# EAGLE design LTM8055 AddonBoard v1.0 (EAGLE 6.4)
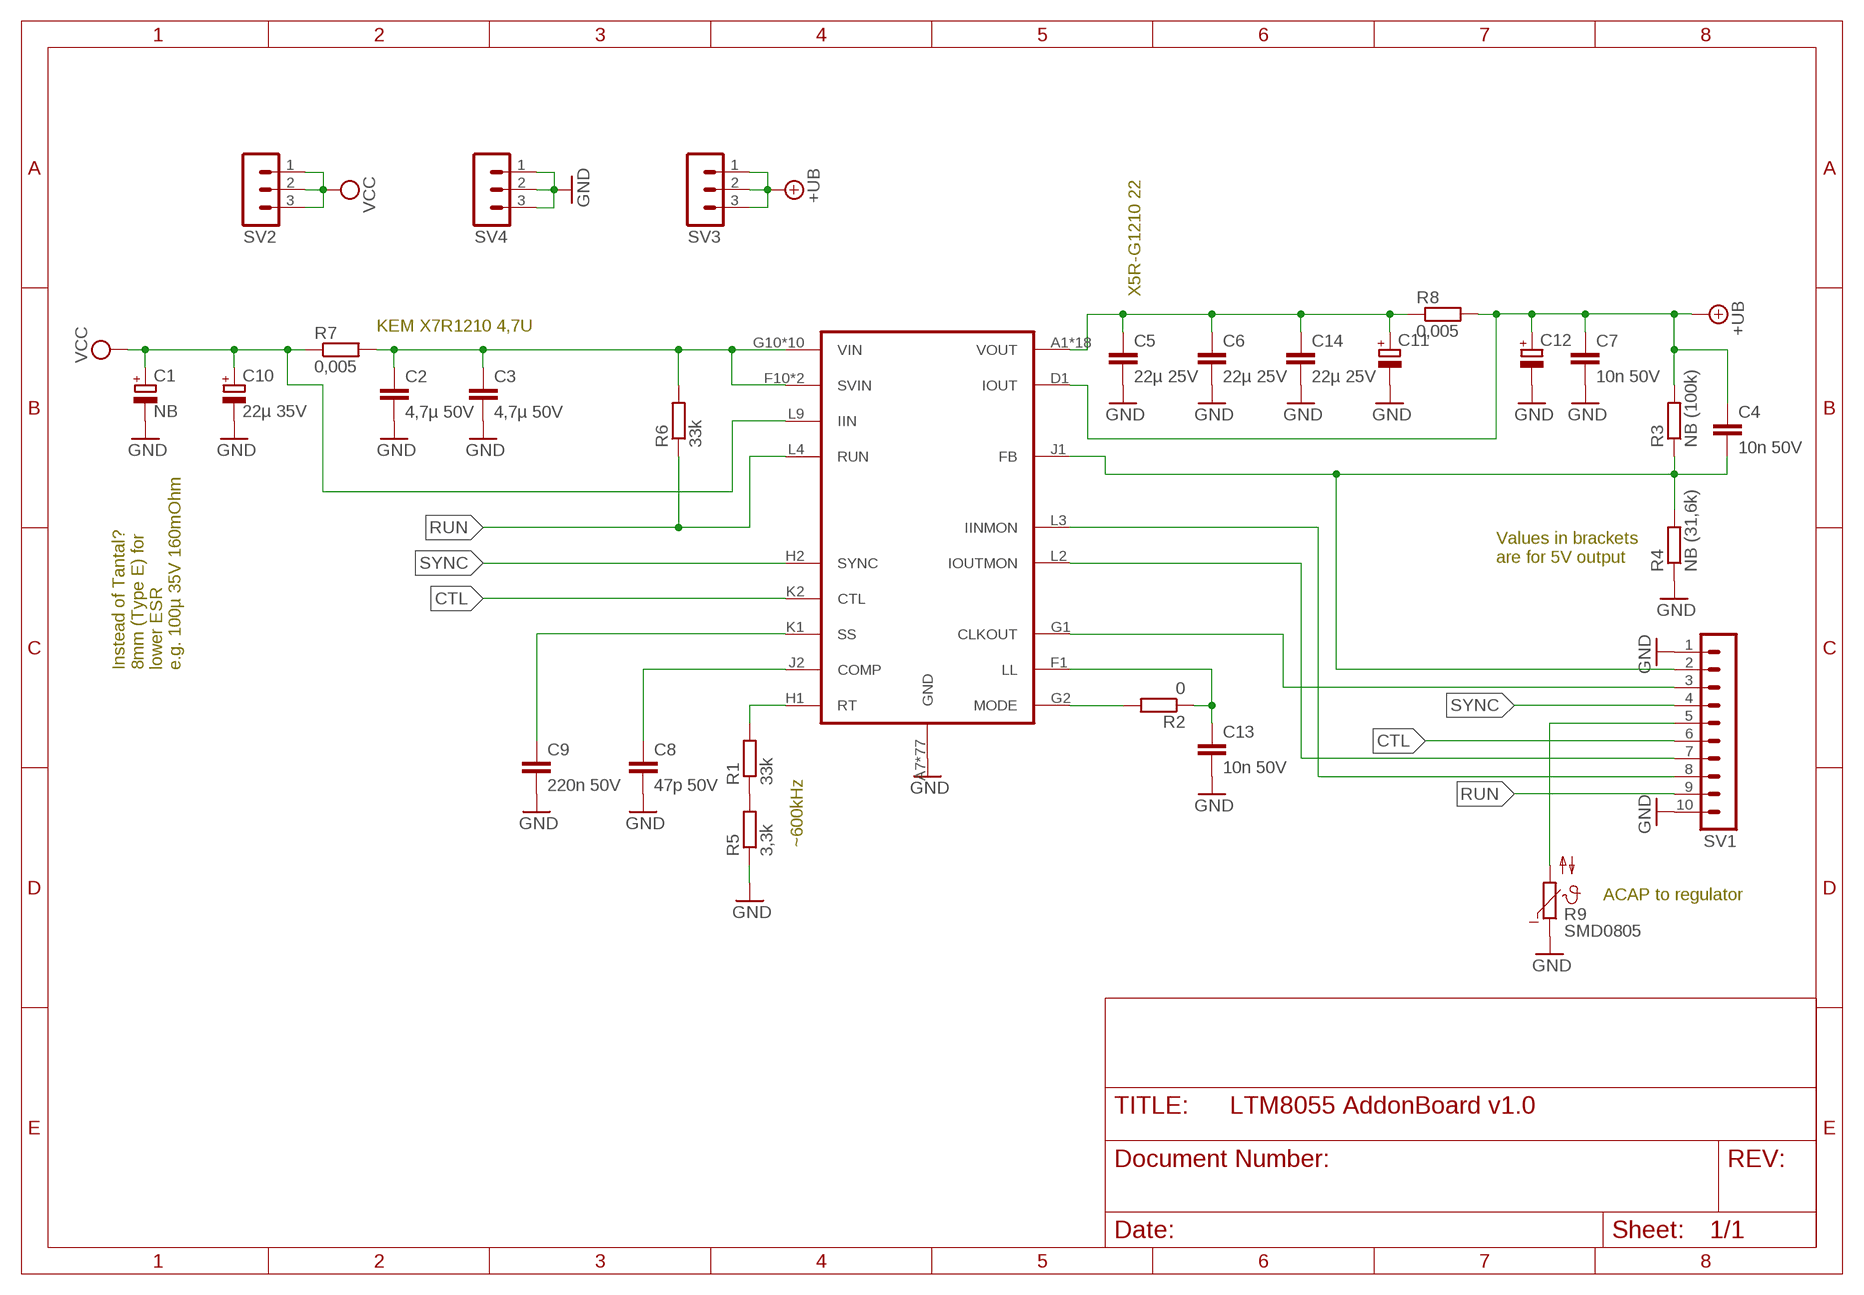
[diagram p0: schematic, sheet 1]

## Parts
C1  NB  CPOL-EUE  [PANASONIC_E]
C2  4,7µ 50V  C-EUC1206  [C1206]
C3  4,7µ 50V  C-EUC1206  [C1206]
C4  10n 50V  C-EUC0805  [C0805]
C5  22µ 25V  C-EUC1210  [C1210]
C6  22µ 25V  C-EUC1210  [C1210]
C7  10n 50V  C-EUC0805  [C0805]
C8  47p 50V  C-EUC0805  [C0805]
C9  220n 50V  C-EUC0805  [C0805]
C10  22µ 35V  CPOL-EUD/7343-31R  [D/7343-31R]
C11  CPOL-EUD/7343-31R  [D/7343-31R]
C12  CPOL-EUD/7343-31R  [D/7343-31R]
C13  10n 50V  C-EUC0805  [C0805]
C14  22µ 25V  C-EUC1210  [C1210]
IC1  LTM8055-1  [BGA121_1.27_15X15MM]
R1  33k  R-EU_R0805  [R0805]
R2  0  R-EU_R0805  [R0805]
R3  NB (100k)  R-EU_R0805  [R0805]
R4  NB (31,6k)  R-EU_R0805  [R0805]
R5  3,3k  R-EU_R0805  [R0805]
R6  33k  R-EU_R0805  [R0805]
R7  0,005  R-EU_R2512  [R2512]
R8  0,005  R-EU_R2512  [R2512]
R9  SMD0805  [R0805]
SV1  MA10-1  [MA10-1]
SV2  MA03-1  [MA03-1]
SV3  MA03-1  [MA03-1]
SV4  MA03-1  [MA03-1]

## Nets
+UB: C4.1 C7.1 C12.+ IC1.D1(IOUT) R3.2 R8.2 SV3.1 SV3.2 SV3.3
CTL: IC1.K2(CTL) SV1.6
GND: C1.- C2.2 C3.2 C5.2 C6.2 C7.2 C8.2 C9.2 C10.- C11.- C12.- C13.2 C14.2 IC1.A7(GND) IC1.A8(GND) IC1.A9(GND) IC1.A10(GND) IC1.A11(GND) IC1.B7(GND) IC1.B8(GND) IC1.B9(GND) IC1.B10(GND) IC1.B11(GND) IC1.C7(GND) IC1.C8(GND) IC1.C9(GND) IC1.C10(GND) IC1.C11(GND) IC1.D2(GND) IC1.D3(GND) IC1.D4(GND) IC1.D5(GND) IC1.D6(GND) IC1.D7(GND) IC1.D8(GND) IC1.D9(GND) IC1.D10(GND) IC1.D11(GND) IC1.E1(GND) IC1.E2(GND) IC1.E3(GND) IC1.E4(GND) IC1.E5(GND) IC1.E6(GND) IC1.E7(GND) IC1.E8(GND) IC1.E9(GND) IC1.E10(GND) IC1.E11(GND) IC1.F2(GND) IC1.F3(GND) IC1.F4(GND) IC1.F5(GND) IC1.F6(GND) IC1.F7(GND) IC1.F8(GND) IC1.F9(GND) IC1.G3(GND) IC1.G4(GND) IC1.G5(GND) IC1.G6(GND) IC1.G7(GND) IC1.G8(GND) IC1.G9(GND) IC1.H3(GND) IC1.H4(GND) IC1.H5(GND) IC1.H6(GND) IC1.H7(GND) IC1.H8(GND) IC1.H9(GND) IC1.J3(GND) IC1.J4(GND) IC1.J5(GND) IC1.J6(GND) IC1.J7(GND) IC1.J8(GND) IC1.J9(GND) IC1.K3(GND) IC1.K4(GND) IC1.K5(GND) IC1.K6(GND) IC1.K7(GND) IC1.K8(GND) IC1.K9(GND) IC1.L1(GND) IC1.L5(GND) IC1.L6(GND) IC1.L7(GND) IC1.L8(GND) R4.1 R5.1 R9.1 SV1.1 SV1.10 SV4.1 SV4.2 SV4.3
N$1: C13.1 IC1.F1(LL) R2.1
N$2: IC1.G2(MODE) R2.2
N$3: IC1.G1(CLKOUT) SV1.3
N$4: C9.1 IC1.K1(SS)
N$5: C4.2 IC1.J1(FB) R3.1 R4.2 SV1.2
N$6: IC1.L2(IOUTMON) SV1.7
N$7: IC1.L3(IINMON) SV1.8
N$8: IC1.H1(RT) R1.2
N$9: C2.1 C3.1 IC1.F10(SVIN) IC1.F11(SVIN) IC1.G10(VIN) IC1.G11(VIN) IC1.H10(VIN) IC1.H11(VIN) IC1.J10(VIN) IC1.J11(VIN) IC1.K10(VIN) IC1.K11(VIN) IC1.L10(VIN) IC1.L11(VIN) R6.2 R7.2
N$10: R1.1 R5.2
N$11: C8.1 IC1.J2(COMP)
N$12: R9.2 SV1.5
N$14: C5.1 C6.1 C11.+ C14.1 IC1.A1(VOUT) IC1.A2(VOUT) IC1.A3(VOUT) IC1.A4(VOUT) IC1.A5(VOUT) IC1.A6(VOUT) IC1.B1(VOUT) IC1.B2(VOUT) IC1.B3(VOUT) IC1.B4(VOUT) IC1.B5(VOUT) IC1.B6(VOUT) IC1.C1(VOUT) IC1.C2(VOUT) IC1.C3(VOUT) IC1.C4(VOUT) IC1.C5(VOUT) IC1.C6(VOUT) R8.1
RUN: IC1.L4(RUN) R6.1 SV1.9
SYNC: IC1.H2(SYNC) SV1.4
VCC: C1.+ C10.+ IC1.L9(IIN) R7.1 SV2.1 SV2.2 SV2.3

## Notes on the sheet
- X5R-G1210 22
- KEM X7R1210 4,7U
- Values in brackets
  are for 5V output
- Instead of Tantal?
  8mm (Type E) for
  lower ESR
  e.g. 100µ 35V 160mOhm
- ~600kHz
- ACAP to regulator

## Library data of the parts
C1 C10-C12 = rcl:CPOL-EU: POLARIZED CAPACITOR, European symbol
C2-C9 C13 C14 = rcl:C-EU: CAPACITOR, European symbol
IC1 = linear-technology:LTM8055: LTM8055/LTM8055-1 36Vin, 8.5A Buck-Boost μModule Regulator FEATURES - Complete Buck-Boost Switch Mode Power Supply - VOUT Equal, Greater, Less Than VIN - Wide Input Voltage Range: 5V to 36V - 12V/3A Output from 6VIN - 12V/6A Output from 12VIN - 12V/8.5A Output from 24VIN - Up to 97.5% Efficient - Adjustable Input and Output Average Current Limits - Input and Output Current Monitors - Parallelable for Increased Output Current - Wide Output Voltage Range: 1.2V to 36V - Selectable Switching Frequency: 100kHz to 800kHz - Synchronization from 200kHz to 700kHz - External Compensation (LTM8055-1) - 15mm × 15mm × 4.92mm BGA Package APPLICATIONS - High Power Battery-Operated Devices - Industrial Control - Solar Powered Voltage Regulator - Solar Powered Battery Charging
R1-R8 = rcl:R-EU_: RESISTOR, European symbol
R9 = ptc-ntc:SMD0805: EPCOS NTC 0805
SV1 = con-lstb:MA10-1: PIN HEADER; OC_FARNELL: unknown; OC_NEWARK: unknown
SV2-SV4 = con-lstb:MA03-1: PIN HEADER; OC_FARNELL: unknown; OC_NEWARK: unknown

## Board
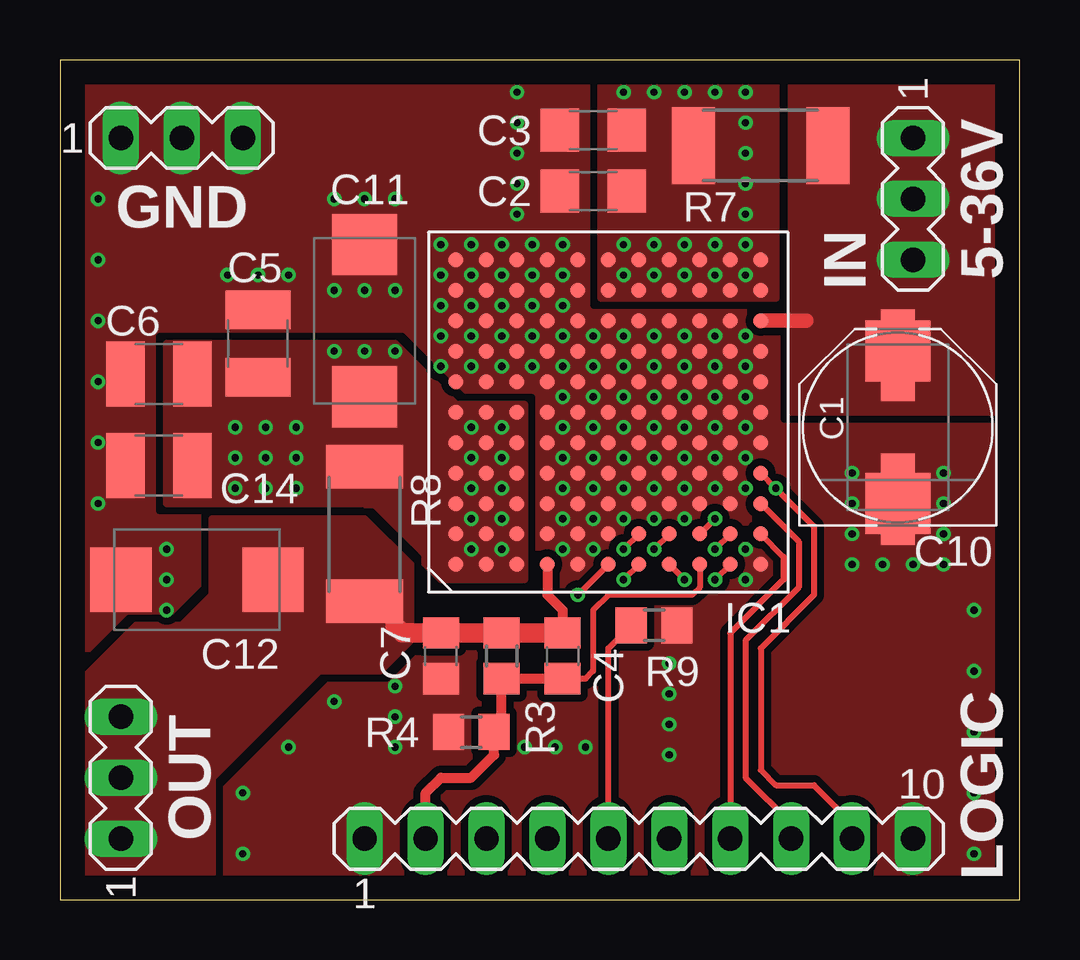
[diagram p1: board, top side]
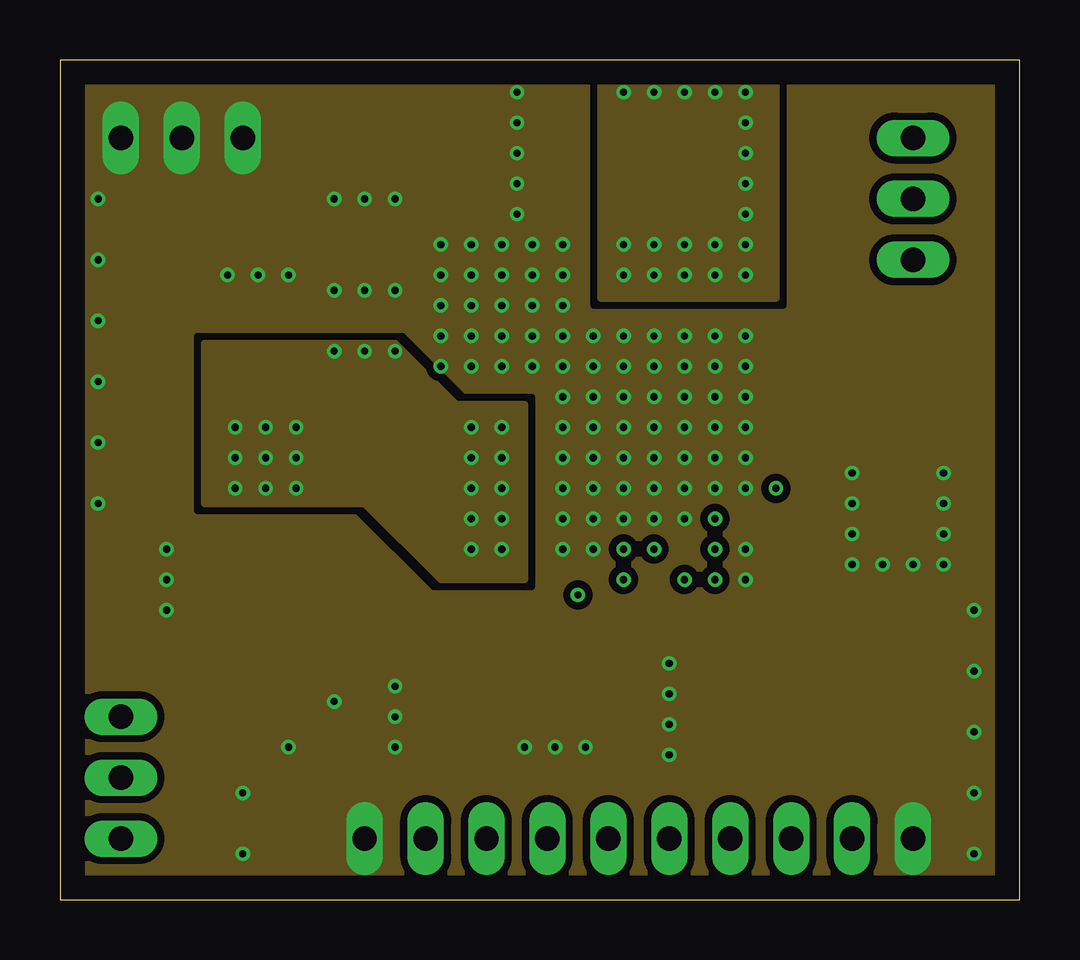
[diagram p2: board, inner layer InnerTop]
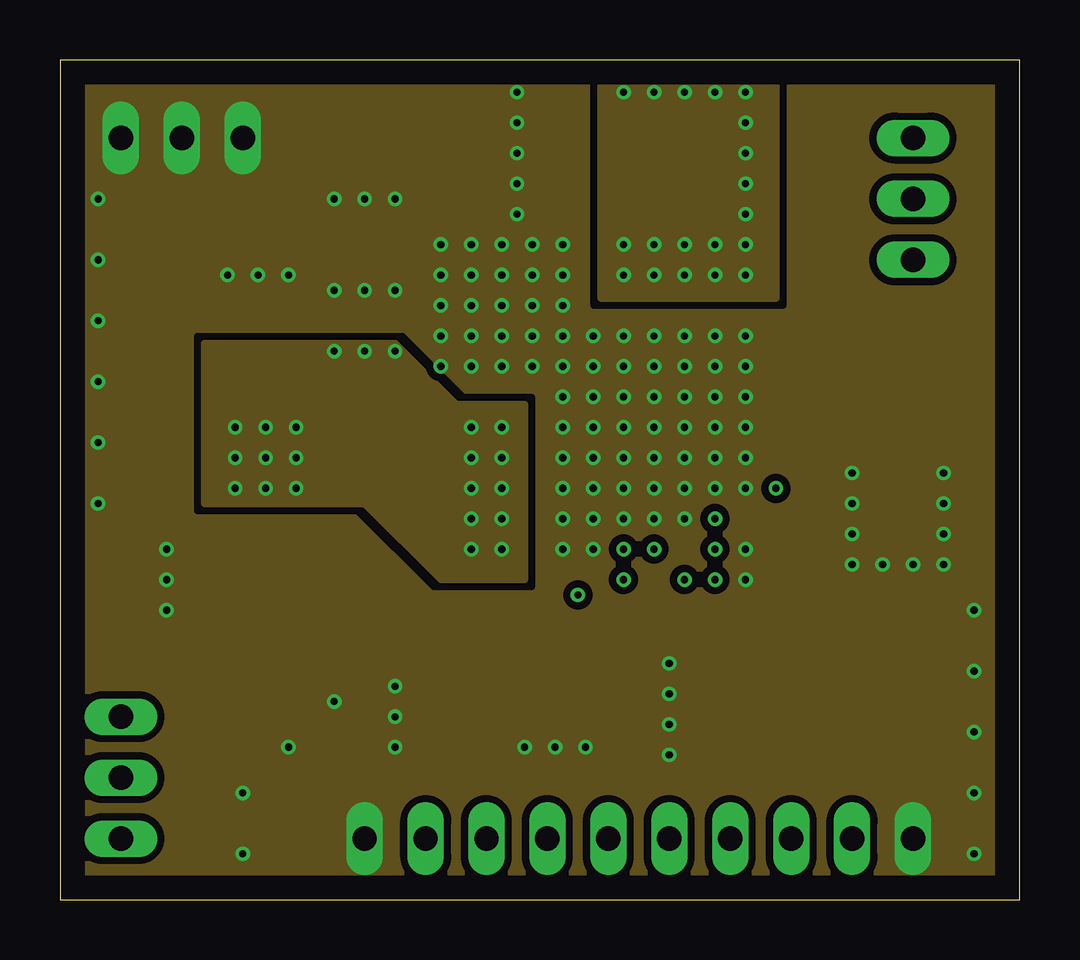
[diagram p3: board, inner layer InnerBottom]
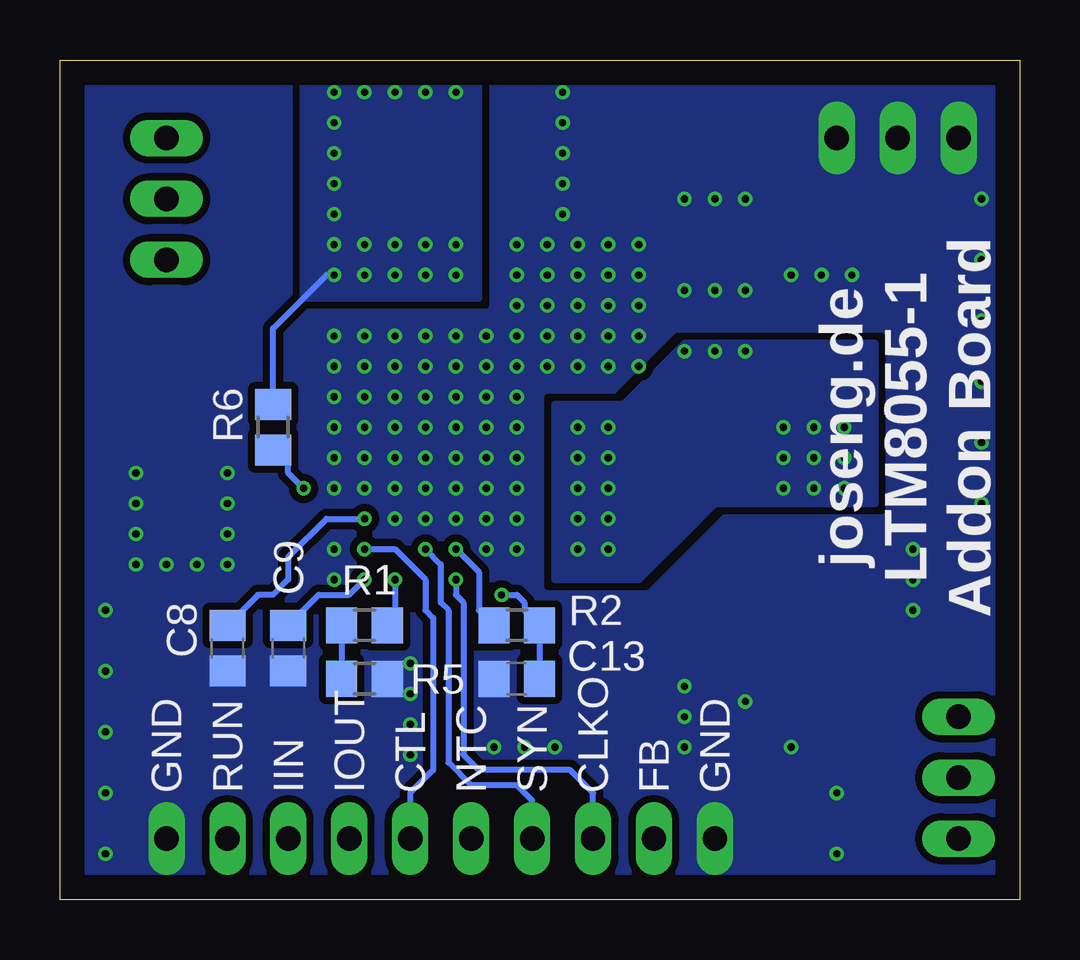
[diagram p4: board, bottom side, seen from below]

Size 40 x 35 mm. Coordinates in mm from the lower left corner, seen from the top.
Outline: 0,0 40,0 40,35 0,35 0,0
Copper layers ((1+2)*(15+16)): Top 0.035mm / dielectric 0.2mm / InnerTop 0.0175mm / dielectric 1.065mm / InnerBottom 0.0175mm / dielectric 0.2mm / Bottom 0.035mm
Design rules "JLCPCB 4Layer 1oz JLC7628": minimum track width 3.5mil, minimum drill 0.2mm, track to track 3.5mil, track to pad 0.2mm, pad to pad 5mil, via to via 0.2mm, smd to smd 5mil, copper to edge 40mil, drill to drill 0.5mm, minimum pad ring 0.15mm, minimum via ring 0.15mm, stop-mask expansion 2mil, vias tented up to drill 0.3mm, thermal gap 10mil

### Footprints (pad centres in the part's own frame; a part is rotated, then mirrored left to right if it is on the bottom)
PANASONIC_E = smd 3.8 x 1.4: + 3,0; - -3,0
C1206 = smd 1.6 x 1.8: 1 -1.4,0; 2 1.4,0
C0805 = smd 1.3 x 1.5: 1 -0.95,0; 2 0.95,0
C1210 = smd 1.6 x 2.7: 1 -1.4,0; 2 1.4,0
D/7343-31R = smd 2.55 x 2.7: + 3.175,0; - -3.175,0
BGA121_1.27_15X15MM = smd 0.635 x 0.635: A1 -6.35,-6.35; A2 -6.35,-5.08; A3 -6.35,-3.81; A4 -6.35,-2.54; A5 -6.35,-1.27; A6 -6.35,0; A7 -6.35,1.27; A8 -6.35,2.54; A9 -6.35,3.81; A10 -6.35,5.08; A11 -6.35,6.35; B1 -5.08,-6.35; B2 -5.08,-5.08; B3 -5.08,-3.81; B4 -5.08,-2.54; B5 -5.08,-1.27; B6 -5.08,0; B7 -5.08,1.27; B8 -5.08,2.54; B9 -5.08,3.81; B10 -5.08,5.08; B11 -5.08,6.35; C1 -3.81,-6.35; C2 -3.81,-5.08; C3 -3.81,-3.81; C4 -3.81,-2.54; C5 -3.81,-1.27; C6 -3.81,0; C7 -3.81,1.27; C8 -3.81,2.54; C9 -3.81,3.81; C10 -3.81,5.08; C11 -3.81,6.35; D1 -2.54,-6.35; D2 -2.54,-5.08; D3 -2.54,-3.81; D4 -2.54,-2.54; D5 -2.54,-1.27; D6 -2.54,0; D7 -2.54,1.27; D8 -2.54,2.54; D9 -2.54,3.81; D10 -2.54,5.08; D11 -2.54,6.35; E1 -1.27,-6.35; E2 -1.27,-5.08; E3 -1.27,-3.81; E4 -1.27,-2.54; E5 -1.27,-1.27; E6 -1.27,0; E7 -1.27,1.27; E8 -1.27,2.54; E9 -1.27,3.81; E10 -1.27,5.08; E11 -1.27,6.35; F1 0,-6.35; F2 0,-5.08; F3 0,-3.81; F4 0,-2.54; F5 0,-1.27; F6 0,0; F7 0,1.27; F8 0,2.54; F9 0,3.81; F10 0,5.08; F11 0,6.35; G1 1.27,-6.35; G2 1.27,-5.08; G3 1.27,-3.81; G4 1.27,-2.54; G5 1.27,-1.27; G6 1.27,0; G7 1.27,1.27; G8 1.27,2.54; G9 1.27,3.81; G10 1.27,5.08; G11 1.27,6.35; H1 2.54,-6.35; H2 2.54,-5.08; H3 2.54,-3.81; H4 2.54,-2.54; H5 2.54,-1.27; H6 2.54,0; H7 2.54,1.27; H8 2.54,2.54; H9 2.54,3.81; H10 2.54,5.08; H11 2.54,6.35; J1 3.81,-6.35; J2 3.81,-5.08; J3 3.81,-3.81; J4 3.81,-2.54; J5 3.81,-1.27; J6 3.81,0; J7 3.81,1.27; J8 3.81,2.54; J9 3.81,3.81; J10 3.81,5.08; J11 3.81,6.35; K1 5.08,-6.35; K2 5.08,-5.08; K3 5.08,-3.81; K4 5.08,-2.54; K5 5.08,-1.27; K6 5.08,0; K7 5.08,1.27; K8 5.08,2.54; K9 5.08,3.81; K10 5.08,5.08; K11 5.08,6.35; L1 6.35,-6.35; L2 6.35,-5.08; L3 6.35,-3.81; L4 6.35,-2.54; L5 6.35,-1.27; L6 6.35,0; L7 6.35,1.27; L8 6.35,2.54; L9 6.35,3.81; L10 6.35,5.08; L11 6.35,6.35
R0805 = smd 1.3 x 1.5: 1 -0.95,0; 2 0.95,0
R2512 = smd 1.8 x 3.2: 1 -2.8,0; 2 2.8,0
MA10-1 = drill 1.016 long: 1 -11.43,0; 2 -8.89,0; 3 -6.35,0; 4 -3.81,0; 5 -1.27,0; 6 1.27,0; 7 3.81,0; 8 6.35,0; 9 8.89,0; 10 11.43,0
MA03-1 = drill 1.016 long: 1 -2.54,0; 2 0,0; 3 2.54,0

### Placement (x,y rotation side)
C1  34.92,19.68 90 top
C2  22.23,29.53 180 top
C3  22.23,32.07 180 top
C4  20.95,10.16 270 top
C5  8.26,23.18 90 top
C6  4.13,21.91 180 top
C7  15.88,10.16 270 top
C8  33.02,10.48 270 bottom
C9  30.48,10.48 270 bottom
C10  34.92,19.68 90 top
C11  12.7,24.13 270 top
C12  5.71,13.34 0 top
C13  20.95,9.21 180 bottom
C14  4.13,18.1 180 top
IC1  22.86,20.32 0 top
R1  27.3,11.43 0 bottom
R2  20.95,11.43 180 bottom
R3  18.41,10.16 90 top
R4  17.14,6.99 0 top
R5  27.3,9.21 180 bottom
R6  31.11,19.68 90 bottom
R7  29.21,31.43 180 top
R8  12.7,15.24 270 top
R9  24.77,11.43 180 top
SV1  24.13,2.54 0 top
SV2  35.56,29.21 270 top
SV3  2.54,5.08 90 top
SV4  5.08,31.75 0 top

### Tracks (layer width: path | path; a pad name or v marks a point on that pad's centre or on a via)
+UB
  Top 0.406: IC1.D1 20.32,12.7 20.95,12.06 C4.1
  Top 0.813: 13.97,11.43 14.29,11.11 C7.1 R3.2 C4.1
  pour Top (isolate 0.305, no thermals): 6.35,15.88 12.7,15.88 14.61,13.97 14.61,10.79 13.34,9.53 10.79,9.53 6.35,5.08 6.35,0.64 0.64,0.64 0.64,8.89 3.17,11.43 5.08,11.43 6.35,12.7
CTL  (via drill 0.3)
  Top 0.254: IC1.K2 v27.3,14.61
  Bottom 0.254: v27.3,14.61 26.04,14.61 24.77,13.34 24.77,12.06 24.45,11.75 24.45,5.4 25.4,4.45 SV1.6
GND  (via drill 0.3)
  other vias: 17.14,26.04 15.88,27.3 17.14,27.3 18.41,27.3 19.68,27.3 20.95,27.3 20.95,26.04 19.68,26.04 18.41,26.04 15.88,26.04 15.88,24.77 17.14,24.77 18.41,24.77 19.68,24.77 20.95,24.77 20.95,23.5 19.68,23.5 18.41,23.5 17.14,23.5 15.88,23.5 15.88,22.23 17.14,22.23 18.41,22.23 19.68,22.23 20.95,22.23 20.95,20.95 20.95,19.68 20.95,18.41 20.95,17.14 20.95,15.88 22.23,15.88 22.23,17.14 22.23,18.41 22.23,19.68 23.5,22.23 23.5,18.41 23.5,17.14 23.5,15.88 24.77,17.14 24.77,18.41 24.77,19.68 26.04,18.41 26.04,17.14 27.3,17.14 28.57,17.14 28.57,18.41 27.3,18.41 27.3,19.68 26.04,19.68 28.57,19.68 22.23,22.23 22.23,20.95 23.5,20.95 23.5,19.68 24.77,20.95 24.77,22.23 26.04,22.23 26.04,20.95 27.3,20.95 27.3,22.23 28.57,22.23 28.57,20.95 28.57,23.5 27.3,23.5 26.04,23.5 24.77,23.5 23.5,23.5 22.23,23.5 9.53,26.04 8.26,26.04 6.99,26.04 1.59,19.05 1.59,16.51 4.45,14.61 4.45,13.34 4.45,12.06 12.7,29.21 13.97,29.21 11.43,29.21 11.43,25.4 12.7,25.4 13.97,25.4 19.05,28.57 19.05,29.84 19.05,31.11 19.05,32.38 19.05,33.66 36.83,17.78 36.83,16.51 36.83,15.24 36.83,13.97 35.56,13.97 34.29,13.97 33.02,13.97 33.02,15.24 33.02,16.51 33.02,17.78 7.62,1.91 7.62,4.45 9.53,6.35 11.43,8.26 13.97,8.89 13.97,7.62 13.97,6.35 38.1,1.91 19.37,6.35 20.64,6.35 21.91,6.35 25.4,9.84 25.4,6.03 25.4,7.3 25.4,8.57 28.57,14.61 28.57,13.34 38.1,4.45 38.1,6.99 38.1,9.53 38.1,12.06 1.59,29.21 1.59,26.67 1.59,24.13 1.59,21.59 20.95,14.61 22.23,14.61 24.77,15.88 26.04,15.88
  pour Top (isolate 0.305, rank 6, no thermals): -5.08,40.01 -5.08,-5.08 45.09,-5.08 45.09,40.01
  pour Bottom (isolate 0.305, rank 6, no thermals): -1.27,36.2 -1.27,-1.27 41.27,-1.27 41.27,36.2
  pour InnerTop (isolate 0.305, rank 6, no thermals): -3.81,38.73 -3.81,-3.81 43.81,-3.81 43.81,38.73
  pour InnerBottom (isolate 0.305, rank 6, no thermals): -2.54,37.47 -2.54,-2.54 42.55,-2.54 42.55,37.47
N$1  (via drill 0.3)
  Top 0.254: IC1.F1 v21.59,12.7
  Bottom 0.254: v21.59,12.7 20.95,12.7 20.64,12.38 20.64,12.06 R2.1 C13.1
N$2  (via drill 0.3)
  Top 0.254: IC1.G2 v23.5,14.61
  Bottom 0.254: v23.5,14.61 22.54,13.65 22.54,12.06 R2.2
N$3  (via drill 0.3)
  Top 0.254: IC1.G1 v23.5,13.34
  Bottom 0.254: v23.5,13.34 23.5,12.7 23.18,12.38 23.18,6.03 22.54,5.4 18.73,5.4 17.78,4.45 SV1.3
N$4  (via drill 0.3)
  Top 0.254: IC1.K1 v27.3,13.34
  Bottom 0.254: v27.3,13.34 27.94,12.7 29.21,12.7 C9.1
N$5
  Top 0.254: IC1.J1 26.67,13.02 26.35,12.7 22.86,12.7 22.23,12.06 22.23,9.53 21.91,9.21 C4.2
  Top 0.406: SV1.2 15.24,4.45 15.88,5.08 17.14,5.08 18.09,6.03 R4.2 18.41,7.3 R3.1 C4.2
N$6
  Top 0.254: SV1.7 27.94,11.11 30.16,13.34 30.16,14.29 IC1.L2
N$7
  Top 0.254: IC1.L3 30.8,14.92 30.8,13.02 28.57,10.79 28.57,5.08 30.48,3.17 SV1.8
N$8  (via drill 0.3)
  Top 0.254: IC1.H1 v26.04,13.34
  Bottom 0.254: v26.04,13.34 26.04,11.75 R1.2
N$9  (via drill 0.3)
  Bottom 0.254: R6.2 31.11,23.81 28.89,26.04 v28.57,26.04
  other vias: 23.5,26.04 24.77,26.04 26.04,26.04 27.3,26.04 28.57,27.3 27.3,27.3 26.04,27.3 24.77,27.3 23.5,27.3 23.5,33.66 24.77,33.66 26.04,33.66 27.3,33.66 28.57,33.66 28.57,32.38 28.57,31.11 28.57,29.84 28.57,28.57
  pour Top (isolate 0.305, no thermals): 22.54,25.08 22.54,34.29 29.84,34.29 29.84,25.08
  pour InnerTop (isolate 0.305, no thermals): 22.54,25.08 22.54,34.29 29.84,34.29 29.84,25.08
  pour InnerBottom (isolate 0.305, no thermals): 22.54,25.08 22.54,34.29 29.84,34.29 29.84,25.08
  pour Bottom (isolate 0.305, no thermals): 22.54,25.08 22.54,34.29 29.84,34.29 29.84,25.08
N$10
  Bottom 0.254: R1.1 R5.2
N$11  (via drill 0.3)
  Top 0.254: IC1.J2 v27.3,15.88
  Bottom 0.254: v27.3,15.88 28.89,15.88 30.48,14.29 30.48,13.34 31.11,12.7 31.75,12.7 C8.1
N$12
  Top 0.254: SV1.5 22.86,10.47 R9.2
N$14  (via drill 0.3)
  other vias: 18.41,19.68 17.14,19.68 17.14,18.41 17.14,17.14 17.14,15.88 18.41,15.88 18.41,17.14 18.41,18.41 18.41,14.61 17.14,14.61 8.57,17.14 8.57,18.41 8.57,19.68 9.84,19.68 9.84,18.41 9.84,17.14 7.3,19.68 7.3,18.41 7.3,17.14 12.7,22.86 13.97,22.86 11.43,22.86
  pour Top (isolate 0.305, rank 2, no thermals): 19.37,20.64 19.37,13.34 15.88,13.34 12.7,16.51 4.45,16.51 4.45,23.18 13.97,23.18 16.51,20.64
  pour InnerTop (isolate 0.305, rank 2, no thermals): 19.37,20.64 19.37,13.34 15.88,13.34 12.7,16.51 6.03,16.51 6.03,23.18 13.97,23.18 16.51,20.64
  pour InnerBottom (isolate 0.305, rank 2, no thermals): 19.37,20.64 19.37,13.34 15.88,13.34 12.7,16.51 6.03,16.51 6.03,23.18 13.97,23.18 16.51,20.64
  pour Bottom (isolate 0.305, rank 2, no thermals): 19.37,20.64 19.37,13.34 15.88,13.34 12.7,16.51 6.03,16.51 6.03,23.18 13.97,23.18 16.51,20.64
RUN  (via drill 0.3)
  Top 0.254: SV1.9 33.02,3.17 31.43,4.76 29.84,4.76 29.21,5.4 29.21,10.48 31.43,12.7 31.43,15.56 v29.84,17.14 IC1.L4
  Bottom 0.254: v29.84,17.14 30.48,17.78 30.48,18.1 R6.1
SYNC  (via drill 0.3)
  Top 0.254: IC1.H2 v24.77,14.61
  Bottom 0.254: SV1.4 20.32,4.13 20.95,4.76 22.86,4.76 23.81,5.71 23.81,12.06 24.13,12.38 24.13,13.97 v24.77,14.61
VCC
  Top 0.61: IC1.L9 31.11,24.13
  pour Top (isolate 0.305, no thermals): 30.48,34.29 39.37,34.29 39.37,20.32 30.48,20.32

### Text on the board
tPlace: GND | 5-36V | IN | OUT | LOGIC
bPlace: joseng.de / LTM8055-1 / Addon Board | GND | FB | CLKO | SYN | NTC | CTL | IOUT | IIN | RUN | GND